# EAGLE schematic untitled (EAGLE 8.7.0)
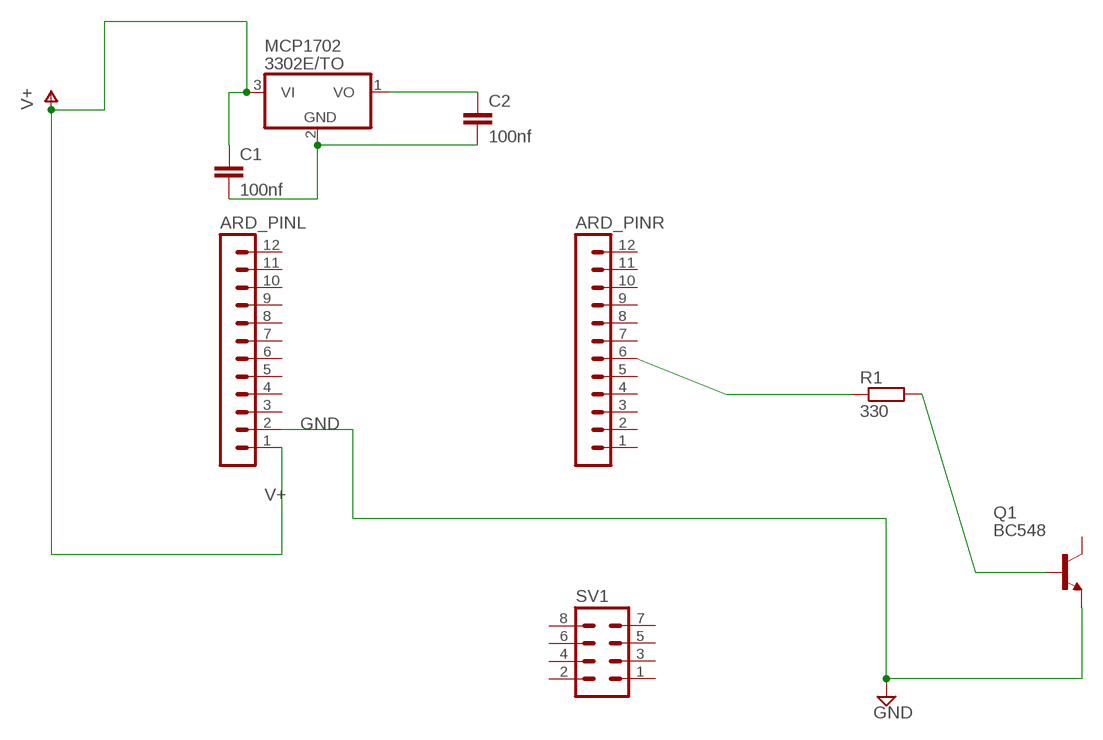
[diagram p0: schematic, sheet 1]

## Parts
ARD_PINL  MA12-1  [MA12-1]
ARD_PINR  MA12-1  [MA12-1]
C1  100nf  C-EU025-024X044  [C025-024X044]
C2  100nf  C-EU025-024X044  [C025-024X044]
MCP1702  3302E/TO  78L05Z  [TO92]
Q1  BC548  [TO92-EBC]
R1  330  R-EU_0204/2V  [0204V]
SV1  MA04-2  [MA04-2]

## Nets
GND: ARD_PINL.2 Q1.E
N$1: ARD_PINR.6 R1.1
N$2: Q1.B R1.2
N$3: C2.1 MCP1702.1(VO)
N$4: C1.2 C2.2 MCP1702.2(GND)
V+: ARD_PINL.1 C1.1 MCP1702.3(VI)
Unconnected: ARD_PINL.3 ARD_PINL.4 ARD_PINL.5 ARD_PINL.6 ARD_PINL.7 ARD_PINL.8 ARD_PINL.9 ARD_PINL.10 ARD_PINL.11 ARD_PINL.12 ARD_PINR.1 ARD_PINR.2 ARD_PINR.3 ARD_PINR.4 ARD_PINR.5 ARD_PINR.7 ARD_PINR.8 ARD_PINR.9 ARD_PINR.10 ARD_PINR.11 ARD_PINR.12 Q1.C SV1.1 SV1.2 SV1.3 SV1.4 SV1.5 SV1.6 SV1.7 SV1.8

## Library data of the parts
ARD_PINL ARD_PINR = con-lstb:MA12-1: PIN HEADER; OC_FARNELL: unknown; OC_NEWARK: unknown
C1 C2 = rcl:C-EU: CAPACITOR, European symbol; SPICEPREFIX: C
MCP1702 = linear:78*: Positive VOLTAGE REGULATOR Source: http://cache.national.com/ds/LM/LM78L05.pdf http://www.fairchildsemi.com/ds/LM/LM7805.pdf
Q1 = transistor-npn:BC548*: NPN Transistor
R1 = rcl:R-EU_: RESISTOR, European symbol; SPICEPREFIX: R
SV1 = con-lstb:MA04-2: PIN HEADER; OC_FARNELL: unknown; OC_NEWARK: unknown